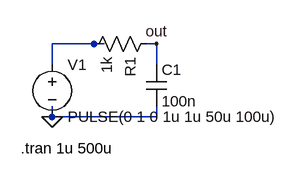
[diagram p0: schematic ltspice_rc.asc]
ltspice_rc.asc, the LTspice schematic file:
Version 4
SHEET 1 880 680
WIRE 0 16 0 -16
WIRE 80 -16 0 -16
WIRE 160 -16 144 -16
WIRE 160 16 160 -16
WIRE 160 96 160 80
WIRE 0 96 0 80
WIRE 160 96 0 96
FLAG 0 96 0
FLAG 160 -16 out
SYMBOL voltage 0 0 R0
SYMATTR InstName V1
SYMATTR Value PULSE(0 1 0 1u 1u 50u 100u)
SYMBOL res 160 -32 R90
SYMATTR InstName R1
SYMATTR Value 1k
SYMBOL cap 144 16 R0
SYMATTR InstName C1
SYMATTR Value 100n
TEXT -48 144 Left 2 !.tran 1u 500u

The netlist it stands for:
* ltspice_rc.asc
V1 N001 0 PULSE(0 1 0 1u 1u 50u 100u)
R1 out N001 1k
C1 out 0 100n
.tran 1u 500u
.backanno
.end